# EAGLE design ttl_adapter (EAGLE 9.6.2)
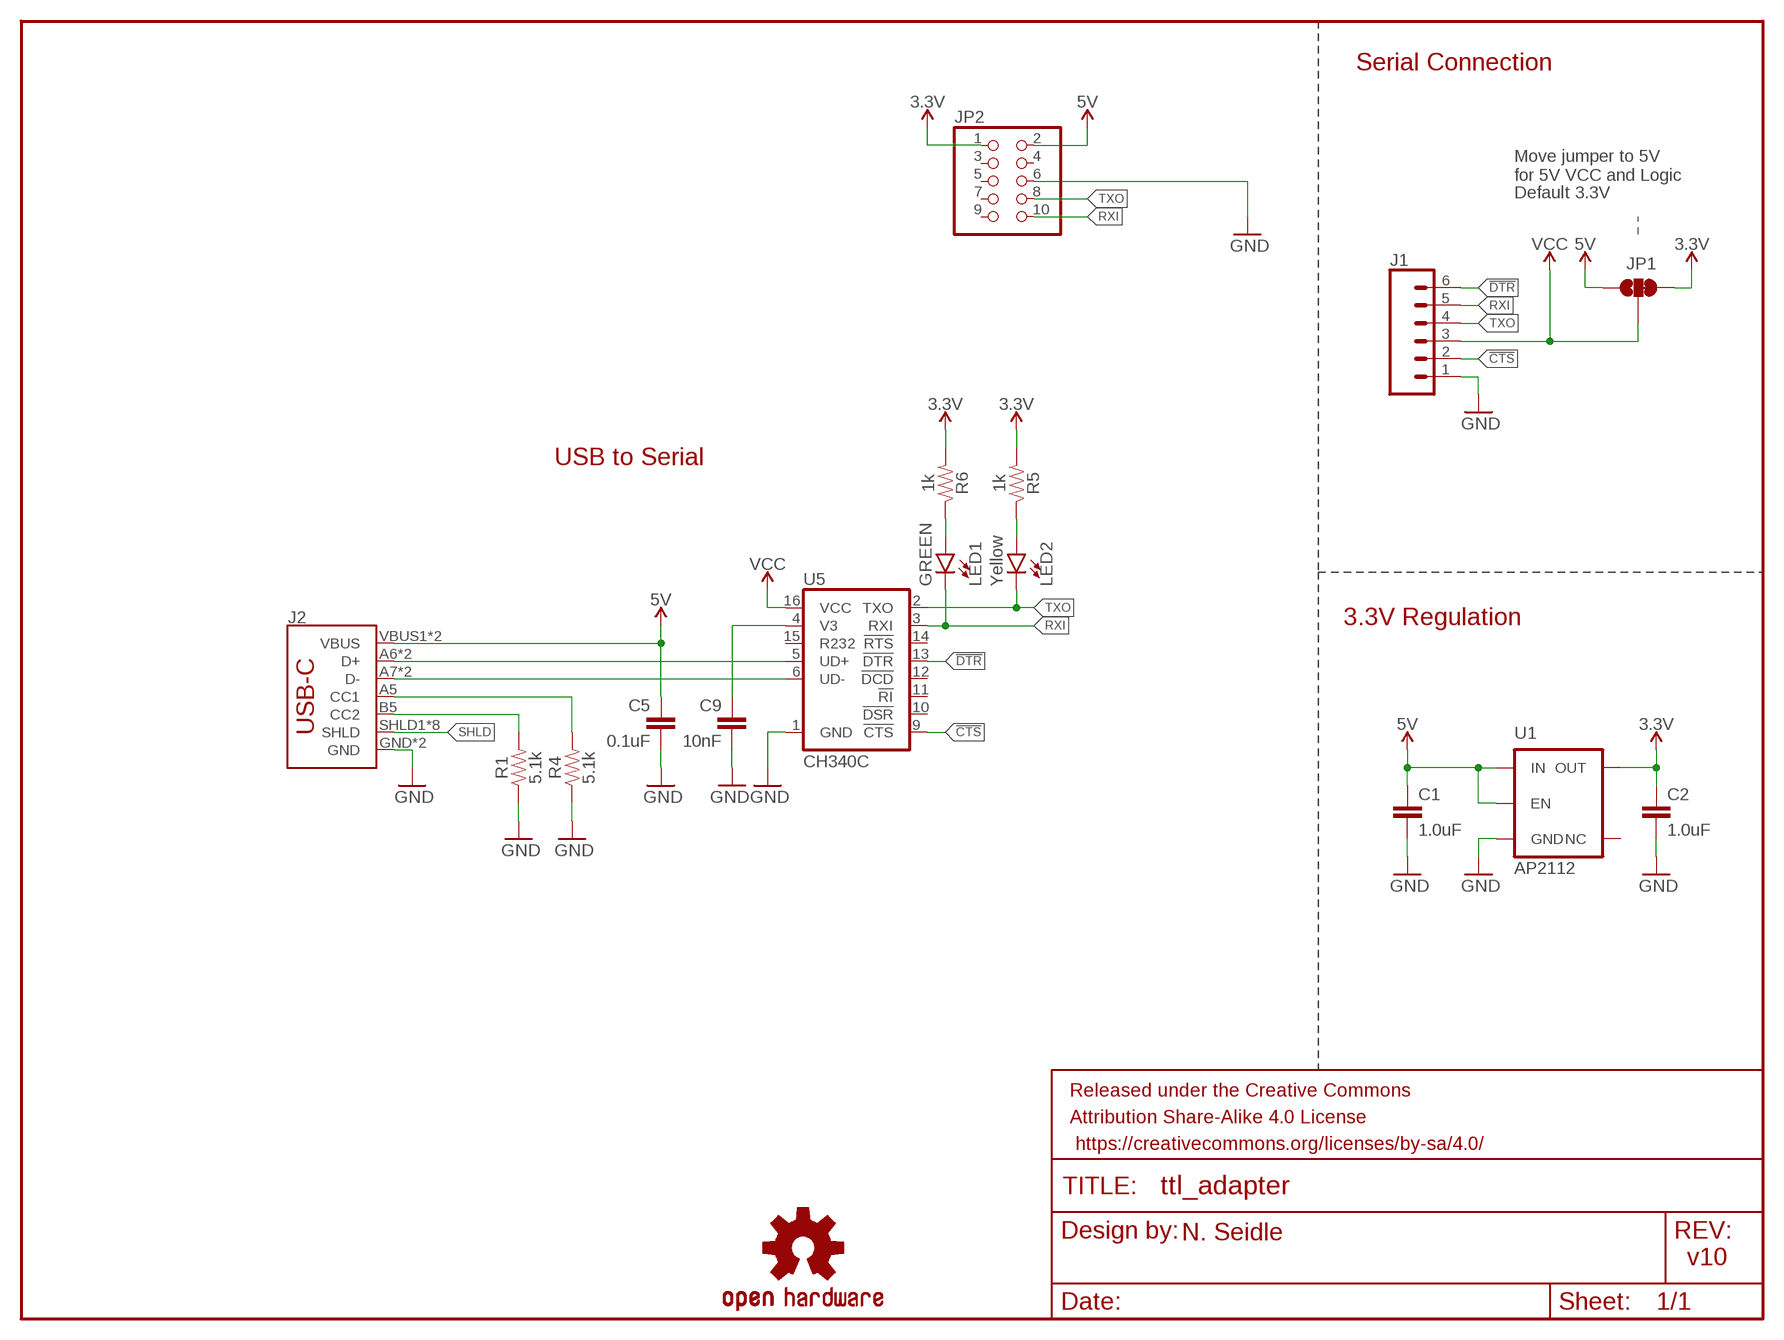
[diagram p0: schematic, sheet 1]

## Parts
C1  1.0uF  1.0UF-0603-16V-10%  [0603]
C2  1.0uF  1.0UF-0603-16V-10%  [0603]
C5  0.1uF  0.1UF-0603-25V-(+80/-20%)  [0603]
C9  10nF  10NF-0603-50V-10%  [0603]
FRAME1  FRAME-LETTER  [CREATIVE_COMMONS]
J1  CONN_06SMD-FEMALE-V2  [1X06-SMD-FEMALE]
J2  USB_C16PIN  [USB-C-16P]
JP1  JUMPER-SMT_3_1-NC_TRACE_SILK  [SMT-JUMPER_3_1-NC_TRACE_SILK]
JP2  PINHD-2X5  [2X05]
LED1  GREEN  LED-GREEN0603  [LED-0603]
LED2  Yellow  LED-YELLOW0603  [LED-0603]
LOGO1  OSHW-LOGOS  [OSHW-LOGO-S]
R1  5.1k  5.1KOHM5.1KOHM-0603-1/10W-1%  [0603]
R4  5.1k  5.1KOHM5.1KOHM-0603-1/10W-1%  [0603]
R5  1k  1KOHM-0603-1/10W-1%  [0603]
R6  1k  1KOHM-0603-1/10W-1%  [0603]
U1  3.3V  V_REG_AP2112K-3.3V  [SOT23-5]
U5  CH340C  [SO016]

## Nets
3.3V [power]: C2.1 JP1.3 JP2.1 R5.2 R6.2 U1.5(OUT)
5V: C1.1 C5.1 J2.VBUS1(VBUS) J2.VBUS2(VBUS) JP1.1 JP2.2 U1.1(IN) U1.3(EN)
!CTS: J1.2 U5.9(!CTS)
!DTR: J1.6 U5.13(!DTR)
CC1: J2.A5(CC1) R4.2
CC2: J2.B5(CC2) R1.2
D+: J2.A6(D+) J2.B6(D+) U5.5(UD+)
D-: J2.A7(D-) J2.B7(D-) U5.6(UD-)
GND [power]: C1.2 C2.2 C5.2 C9.2 J1.1 J2.GND J2.GND2(GND) JP2.6 R1.1 R4.1 U1.2(GND) U5.1(GND)
N$1: C9.1 U5.4(V3)
N$10: LED1.A R6.1
N$11: LED2.A R5.1
RXI: J1.5 JP2.10 LED1.C U5.3(RXI)
SHLD: J2.SHLD1(SHLD) J2.SHLD2(SHLD) J2.SHLD3(SHLD) J2.SHLD4(SHLD) J2.SHLD5(SHLD) J2.SHLD6(SHLD) J2.SHLD7(SHLD) J2.SHLD8(SHLD)
TXO: J1.4 JP2.8 LED2.C U5.2(TXO)
VCC: J1.3 JP1.2 U5.16(VCC)
Unconnected: JP2.3 JP2.4 JP2.5 JP2.7 JP2.9 U1.4(NC) U5.10(!DSR) U5.11(!RI) U5.12(!DCD) U5.14(!RTS) U5.15(R232)

## Notes on the sheet
- Serial Connection
- Move jumper to 5V
  for 5V VCC and Logic
- Default 3.3V
- USB to Serial
- 3.3V Regulation
- AP2112
- N. Seidle
- v10

## Library data of the parts
C1 C2 = SparkFun-Capacitors:1.0UF: 1µF ceramic capacitors A capacitor is a passive two-terminal electrical component used to store electrical energy temporarily in an electric field.; PROD_ID: CAP-00868
C5 = SparkFun-Capacitors:0.1UF: 0.1µF ceramic capacitors A capacitor is a passive two-terminal electrical component used to store electrical energy temporarily in an electric field.; PROD_ID: CAP-00810
C9 = SparkFun-Capacitors:10NF: 0.01uF/10nF/10,000pF ceramic capacitors A capacitor is a passive two-terminal electrical component used to store electrical energy temporarily in an electric field. CAP-09321; PROD_ID: CAP-00867
FRAME1 = SparkFun-Aesthetics:FRAME-LETTER: Schematic Frame - Letter Standard 8.5x11 US Letter frame
J1 = SparkFun-Connectors:CONN_06: Multi connection point. Often used as Generic Header-pin footprint for 0.1 inch spaced/style header connections On any of the 0.1 inch spaced packages, you can populate with these: Break Away Headers - Straight <https://www.sparkfun.com/products/116> (PRT-00116) Break Away Male Headers - Right Angle <https://www.sparkfun.com/products/553> (PRT-00553) Female Headers <https://www.sparkfun.com/products/115> (PRT-00115) Break Away Headers - Machine Pin <https://www.sparkfun.com/products/117> (PRT-00117) Break Away Female Headers - Swiss Machine Pin <https://www.sparkfun.com/products/743> (PRT-00743) Arduino Stackable Header - 6 Pin <https://www.sparkfun.com/products/9280> (PRT-09280) For SCREWTERMINALS and SPRING TERMINALS visit here: Screw Terimnals on SparkFun.com <https://www.sparkfun.com/search/results?term=Screw+Terminals> (5mm/3.5mm/2.54mm spacing) This device is also useful as a general connection point to wire up your design to another part of your project. Our various solder wires solder well into these plated through hole pads. Hook-Up Wire - Assortment (Stranded, 22 AWG) <https://www.sparkfun.com/products/11375> (PRT-11375) Hook-Up Wire - Assortment (Solid Core, 22 AWG) <https://www.sparkfun.com/products/11367> (PRT-11367) View the entire wire category on our website here <https://www.sparkfun.com/categories/141>; PROD_ID: CONN-09668
J2 = SparkFun-Connectors:USB_C: USB Type C 16Pin Connector Super Speed pins not available on the 16-pin purely SMD connector so this part is best for USB 2.0 implementations. D1 and D2 are tied together enabling D+/- no matter which way the cable is plugged into the connector. The two channel configuration pins (CC1/2) are exposed. These are normally connected to ground via 5.1k resistors but can be reconfigured for high current/high power applications.; PROD_ID: CONN-14122
JP1 = SparkFun-Jumpers:JUMPER-SMT_3_1-NC_TRACE: Normally closed trace jumper (1 of 2 connections) This jumper has a trace between two pads so it's normally closed (NC). The other connection is normally open (NO). Use a razor knife to open the connection. For best results follow the IPC guidelines for cutting traces: Cutout at least 0.063 mm (0.005 in). Remove all loose material to clean up the cut area. Seal the cut with an approved epoxy. Reapply solder to reclose the connection, or to close the NO connection.
JP2 = pinhead:PINHD-2X5: PIN HEADER
LED1 = SparkFun-LED:LED-GREEN: Green SMD LED Used in manufacturing of various products at SparkFun Packages: 0603 - SMD 0603 package [Product Link] <http://www.futureelectronics.com/en/technologies/semiconductors/optoelectronics/leds/Pages/9894312-LTST-C190GKT.aspx?CrossPart=HSMG-C190&IM=0> LilyPad 1206 - SMD1206 LilyPad package [Product Link] <http://www.futureelectronics.com/en/Technologies/Product.aspx?ProductID=IN150NGHARVATEKCORPORATION2049943&IM=0> 1206 - SMD1206 package [Product Link] <http://www.futureelectronics.com/en/technologies/semiconductors/optoelectronics/leds/Pages/8315665-LTST-C150KGKT.aspx?IM=0> 1206 Bottom Mount -SMD 1206 Bottom Mount [Product Link] <http://www.digikey.com/product-detail/en/lite-on-inc/LTST-C230KGKT/160-1456-1-ND/386854> SparkFun Products: Pro Mini 328 -5V <https://www.sparkfun.com/products/821> RedBoard <https://www.sparkfun.com/products/12757> MP3 Trigger <https://www.sparkfun.com/products/13720> Makey Makey <https://www.sparkfun.com/products/11076>; PROD_ID: DIO-00821
LED2 = SparkFun-LED:LED-YELLOW: Yellow SMD LED Used in manufacturing several products at SparkFun. Packages: 0603 - SMD 0603 package[Product Link] <http://www.kingbrightusa.com/product.asp?catalog_name=LED&product_id=APT1608SYCK> 0603 -SMART - SMART SMD 0603 package (more efficient/more expensive) [Product Link] <http://www.osram-os.com/osram_os/en/products/product-catalog/led-light-emitting-diodes/smartled-0603/ly-l29k/index.jsp> LilyPad - SMD1206 package[Product Datasheet] <https://www.sparkfun.com/datasheets/DevTools/LilyPad/Q150YUS4.pdf> SparkFun Products: Blynk Board <https://www.sparkfun.com/products/13794> IOIO-OTG <https://www.sparkfun.com/products/13613> XBee Explorer Serial <https://www.sparkfun.com/products/13225>; PROD_ID: DIO-09003
LOGO1 = SparkFun-Aesthetics:OSHW-LOGO: Open-Source Hardware (OSHW) Logo This logo indicates the piece of hardware it is found on incorporates a OSHW license and/or adheres to the definition of open source hardware found here: http://freedomdefined.org/OSHW
R1 R4 = SparkFun-Resistors:5.1KOHM; PROD_ID: RES-12083
R5 R6 = SparkFun-Resistors:1KOHM: 1kΩ resistor A resistor is a passive two-terminal electrical component that implements electrical resistance as a circuit element. Resistors act to reduce current flow, and, at the same time, act to lower voltage levels within circuits. - Wikipedia; PROD_ID: RES-07856
U1 = SparkFun-IC-Power:V_REG_AP2112: AP2112 - 600mA CMOS LDO Regulator w/ Enable The AP2112 is CMOS process low dropout linear regulator with enable function, the regulator delivers a guaranteed 600mA (min.) continuous load current. Features Output Voltage Accuracy: ±1.5% Output Current: 600mA (Min.) Foldback Short Current Protection: 50mA Enable Function to Turn ON/OFF VOUT Low Dropout Voltage (3.3V): 250mV (Typ.) @IOUT=600mA Excellent Load Regulation: 0.2%/A (Typ.) Excellent Line Regulation: 0.02%/V (Typ.) Low Quiescent Current: 55μA (Typ.) Low Standby Current: 0.01μA (Typ.) Low Output Noise: 50μVRMS PSRR: 100Hz -65dB, 1kHz -65dB OTSD Protection Stable with 1.0μF Flexible Cap: Ceramic, Tantalum and Aluminum Electrolytic Operation Temperature Range: -40°C to 85°C ESD: MM 400V, HBM 4000V; PROD_ID: VREG-12457
U5 = SparkFun-IC-Comms:CH340C; PROD_ID: IC-14038

## Net classes
1 power: width 0.178 mm

## Board
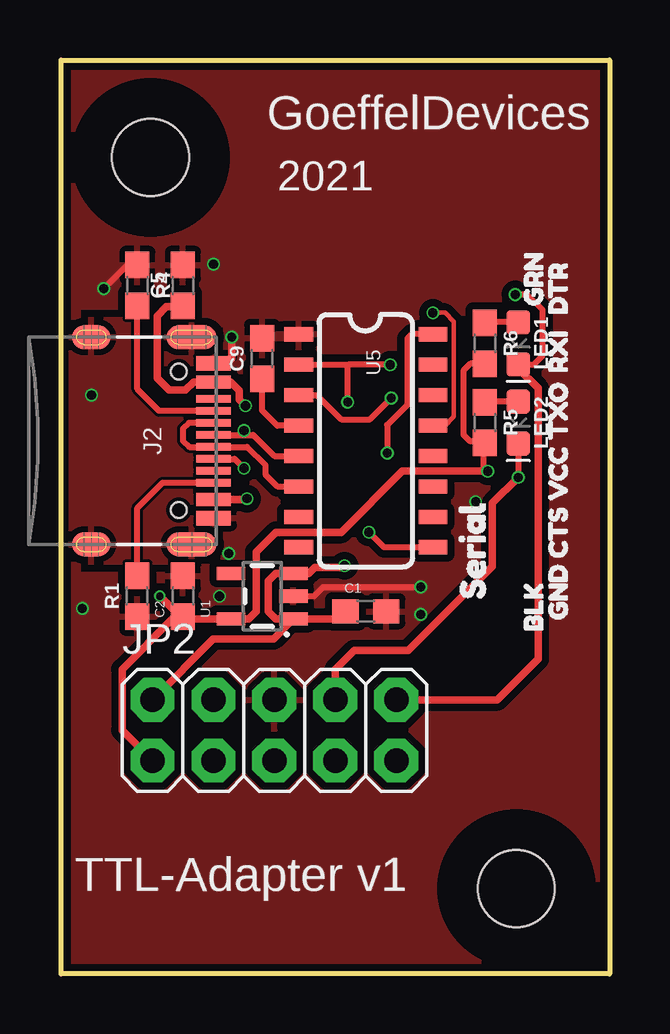
[diagram p1: board, top side]
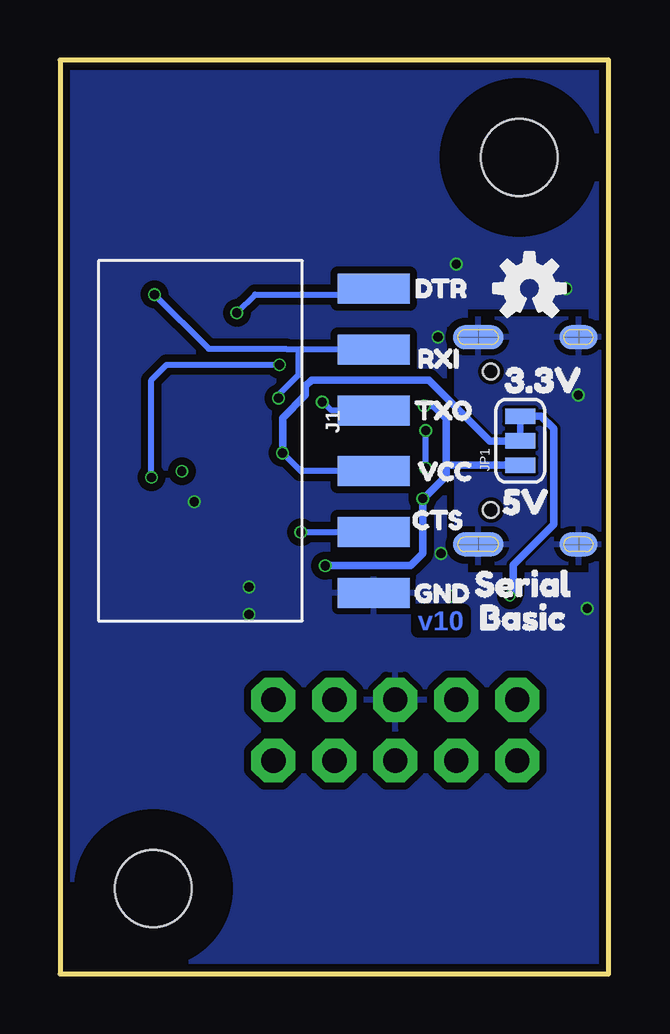
[diagram p2: board, bottom side, seen from below]

Size 22.86 x 38.1 mm. Coordinates in mm from the lower left corner, seen from the top.
Outline: 22.86,0 0,0 0,38.1 22.86,38.1 22.86,0
Copper layers (1*16): Top 0.035mm / dielectric 1.6mm / Bottom 0.035mm
Design rules "jlcpcb-2layers": minimum track width 5mil, minimum drill 0.3mm, track to track 5mil, track to pad 5mil, pad to pad 5mil, via to via 5mil, smd to smd 5mil, copper to edge 0.2mm, drill to drill 6mil, minimum pad ring 10mil, minimum via ring 3mil, stop-mask expansion 4mil, vias tented up to drill 0mil, thermal gap 10mil

### Footprints (pad centres in the part's own frame; a part is rotated, then mirrored left to right if it is on the bottom)
0603 = smd 1.1 x 1: 1 -0.85,0; 2 0.85,0
1X06-SMD-FEMALE = smd 1.25 x 3: 1 6.35,3.425; 2 3.81,3.425; 3 1.27,3.425; 4 -1.27,3.425; 5 -3.81,3.425; 6 -6.35,3.425
USB-C-16P = smd 0.3 x 1.45: A5 -1.25,0; A6 -0.25,0; A7 0.25,0; A8 1.25,0; B5 1.75,0; B6 0.75,0; B7 -0.75,0; B8 -1.75,0 | smd 0.6 x 1.45: GND -3.225,0; GND2 3.225,0 | smd 1 x 2.1: SHLD1 -4.32,-0.915; SHLD2 4.32,-0.915 | smd 1 x 2.1 bottom: SHLD3 -4.32,-0.915; SHLD4 4.32,-0.915 | smd 1 x 1.6: SHLD5 -4.32,-5.095; SHLD8 4.32,-5.095 | smd 1 x 1.6 bottom: SHLD6 -4.32,-5.095; SHLD7 4.32,-5.095 | smd 0.55 x 1.45: VBUS1 -2.45,0; VBUS2 2.45,0 | hole 0.65: -2.89,-1.445; 2.89,-1.445
SMT-JUMPER_3_1-NC_TRACE_SILK = smd 0.635 x 1.27: 1 -1.016,0; 2 0,0; 3 1.016,0
2X05 = drill 1.016 octagon: 1 -5.08,-1.27; 2 -5.08,1.27; 3 -2.54,-1.27; 4 -2.54,1.27; 5 0,-1.27; 6 0,1.27; 7 2.54,-1.27; 8 2.54,1.27; 9 5.08,-1.27; 10 5.08,1.27
LED-0603 = smd 1 x 1: A -0.877,0; C 0.877,0
SOT23-5 = smd 0.55 x 1.2: 1 -0.95,-1.3; 2 0,-1.3; 3 0.95,-1.3; 4 0.95,1.3; 5 -0.95,1.3
SO016 = smd 0.6 x 1.2: 1 -4.445,-2.8; 2 -3.175,-2.8; 3 -1.905,-2.8; 4 -0.635,-2.8; 5 0.635,-2.8; 6 1.905,-2.8; 7 3.175,-2.8; 8 4.445,-2.8; 9 4.445,2.8; 10 3.175,2.8; 11 1.905,2.8; 12 0.635,2.8; 13 -0.635,2.8; 14 -1.905,2.8; 15 -3.175,2.8; 16 -4.445,2.8
M3-HOLE = hole 3.2: 0,0

### Placement (x,y rotation side)
C1  12.7,15.11 0 top
C2  5.08,15.75 90 top
C5  5.08,28.7 90 top
C9  8.38,25.65 90 top
FRAME1  -9.58,-17.78 0 top  (outside the outline)
J1  13.21,22.23 270 bottom
J2  6.35,22.23 270 top
JP1  3.68,22.23 90 bottom
JP2  8.89,10.16 0 top
LED1  19.05,26.29 270 top
LED2  19.05,22.99 270 top
LOGO1  3.3,28.58 0 bottom
R1  3.17,15.75 90 top
R4  3.17,28.7 270 top
R5  17.65,22.99 270 top
R6  17.65,26.29 270 top
U1  8.38,15.75 90 top
U5  12.7,22.23 270 top
U$1  [CTS1]  20.7,16.64 90 top
U$2  [3#3V8]  5.33,24.77 0 bottom
U$3  [5V9]  5.33,19.69 0 bottom
U$4  [SERIAL0]  17.14,14.73 90 top
U$5  [TXO0]  20.7,21.59 90 top
U$6  [VCC2]  20.7,18.92 90 top
U$8  [DTR0]  8.76,28.58 0 bottom
U$9  [SERIAL0]  6.48,16.26 0 bottom
U$10  [RXI1]  8.64,25.65 0 bottom
U$11  [BASIC1]  6.48,14.86 0 bottom
U$12  [TXO0]  8.76,23.5 0 bottom
U$13  [VCC2]  8.76,20.96 0 bottom
U$14  [CTS1]  8.89,18.92 0 bottom
U$15  [GND5]  8.76,15.88 0 bottom
U$16  [M3-HOLE]  18.97,3.56 0 top
U$17  [BLK6]  19.68,13.59 90 top
U$18  [DTR0]  20.7,26.8 90 top
U$19  [GND5]  20.7,14.1 90 top
U$20  [GRN7]  19.68,27.18 90 top
U$21  [RXI1]  20.7,24.38 90 top
U$22  [M3-HOLE]  3.73,34.04 0 top

### Tracks (layer width: path | path; a pad name or v marks a point on that pad's centre or on a via)
3.3V  (via drill 0.3, 0.38)
  Top 0.254: U1.5 5.18,14.8 C2.1 | R6.2 17.06,25.44 16.76,25.15 16.76,22.48 17.02,22.23 17.57,22.23 17.61,22.18 | 17.61,22.18 R5.2 | v17.78,20.96 17.61,21.13 17.61,22.18
  Top 0.305: v17.78,20.96 14.22,20.96 11.68,18.41 8.95,18.41 8.13,17.59 8.13,15.11 7.81,14.8 U1.5 4.64,14.8 2.54,12.7 2.54,10.16 JP2.1 | v4.12,15.75 4.96,14.9 C2.1
  Bottom 0.305: v4.12,15.75 3.97,15.9 3.97,17.05 2.29,18.73 2.29,22.73 2.82,23.27 3.81,23.27 3.79,23.24 JP1.3
5V  (via drill 0.38)
  Top 0.254: 11.54,14.8 C1.1 | v11.81,17.02 11.74,16.95
  Top 0.305: U1.1 11.54,14.8 | 11.74,16.95 10.57,16.95 10.32,16.7 U1.3 8.95,16.7 8.64,16.38 8.64,15.11 8.95,14.8 U1.1 | C5.1 5.12,27.81 4.39,27.81 4,27.43 4,24.83 4.51,24.33 5.18,24.33 5.52,24.68 J2.VBUS1 7.08,24.68 7.43,24.32 7.43,23.94 v7.68,23.69 | J2.VBUS2 7.71,19.77 v7.75,19.81 | U1.1 8.85,13.97 6.35,13.97 JP2.2
  Bottom 0.305: 6.76,21.21 6.76,20.76 7.71,19.81 v7.75,19.81 7.75,17.53 8.26,17.02 v11.81,17.02 | 6.76,21.21 6.76,23.15 7.3,23.69 v7.68,23.69 | JP1.1 6.76,21.21
!CTS  (via drill 0.38)
  Top 0.254: U5.9 13.46,17.78 v12.83,18.41
  Bottom 0.254: v12.83,18.41 J1.2
!DTR  (via drill 0.38)
  Top 0.178: U5.13 16,22.86 16.37,23.23 16.37,27.19 16,27.56 v15.49,27.56
  Bottom 0.254: J1.6 10.04,28.32 14.73,28.32 v15.49,27.56
CC1
  Top 0.254: R4.2 3.17,24.38 4.08,23.48 J2.A5
CC2
  Top 0.254: R1.2 3.17,19.43 4.22,20.48 J2.B5
D+  (via drill 0.38)
  Top 0.254: U5.5 8.89,21.59 8.01,22.48 7.62,22.48 | J2.A6 7.62,22.48 | J2.B6 7.23,21.48 v7.62,21.08 | v7.62,22.65 7.62,22.48
  Bottom 0.254: v7.62,21.08 v7.62,22.65
D-
  Top 0.254: U5.6 9.02,20.32 8.51,20.83 8.51,21.21 7.74,21.98 J2.A7 5.34,21.98 5.33,21.97 5.08,22.23 5.08,22.73 5.32,22.98 J2.B7
GND  (via drill 0.38)
  Top 0.254: R4.1 2.75,29.55 v1.78,28.58 | U1.2 10.54,15.75 10.92,16.13 v14.99,16.13
  Top 0.305: J2.GND 6.91,25.45 7.11,25.65 v7.11,26.54
  other vias: 6.35,29.59 14.99,14.99 6.6,15.75 0.89,15.24 6.99,17.53 17.27,19.69
  pour Top (isolate 0.305, rank 3): 0,38.1 22.86,38.1 22.86,0 0,0
  pour Bottom (isolate 0.305, rank 3): 0,38.1 22.86,38.1 22.86,0 0,0
N$1
  Top 0.254: U5.4 9.02,22.86 8.38,23.5 C9.1
N$10
  Top 0.254: LED1.A 17.68,27.17 R6.1
N$11
  Top 0.254: LED2.A 17.68,23.86 R5.1
RXI  (via drill 0.38)
  Top 0.254: U5.3 10.66,24.13 11.68,23.11 12.87,23.11 v13.75,24 | LED1.C 19.7,25.41 20.07,25.78 20.07,27.69 19.43,28.32 v18.92,28.32
  Top 0.305: JP2.10 18.18,11.43 19.88,13.13 19.88,24.41 19.05,25.24 LED1.C
  Bottom 0.254: v13.75,24 13.75,24.15 12.92,24.99 12.92,25.95 12.83,26.04 | v18.92,28.32 16.67,26.07 13.44,26.07 13.41,26.04 12.83,26.04 | J1.5 12.83,26.04
SHLD  (via drill 0.38)
  other vias: 1.27,24.13
  pour Bottom: 0,27.3 6.35,27.3 6.35,17.14 0,17.14
  pour Top: 0,27.3 6.35,27.3 6.35,17.14 0,17.14
TXO  (via drill 0.38)
  Top 0.254: LED2.C v19.05,20.7 | v13.72,25.39 11.97,25.39 11.96,25.4 11.94,25.4 | U5.2 11.94,25.4 | v11.94,23.84 11.94,25.4
  Top 0.305: v19.05,20.7 17.97,19.62 17.97,16.98 14.46,13.48 12.21,13.48 11.43,12.7 JP2.8
  Bottom 0.254: v13.72,25.39 18.41,25.39 19.05,24.76 v19.05,20.7 | J1.4 11.56,23.5 11.9,23.84 v11.94,23.84
VCC  (via drill 0.38)
  Top 0.254: U5.16 14.61,26.67 14.43,26.49 14.43,23.72 13.59,22.89 v13.59,21.72
  Bottom 0.254: J1.3 12.83,20.96 v13.59,21.72
  Bottom 0.305: JP1.2 4.95,22.23 7.49,24.77 12.38,24.77 12.64,24.51 12.64,24.13 13.59,23.18 v13.59,21.72

### Text on the board
Bottom: v10
tNames: GoeffelDevices | 2021 | TTL-Adapter v1
tValues: Close
Measures: All dimensions in inches